# EAGLE schematic MotorBoardDev (EAGLE 8.5.2)
IGVC Motor Control Board
REVISION: v1.1; SCH_DESC: Motor Control Board; TEAM: IGVC

## Sheet 1 of 4: mBed Breakout
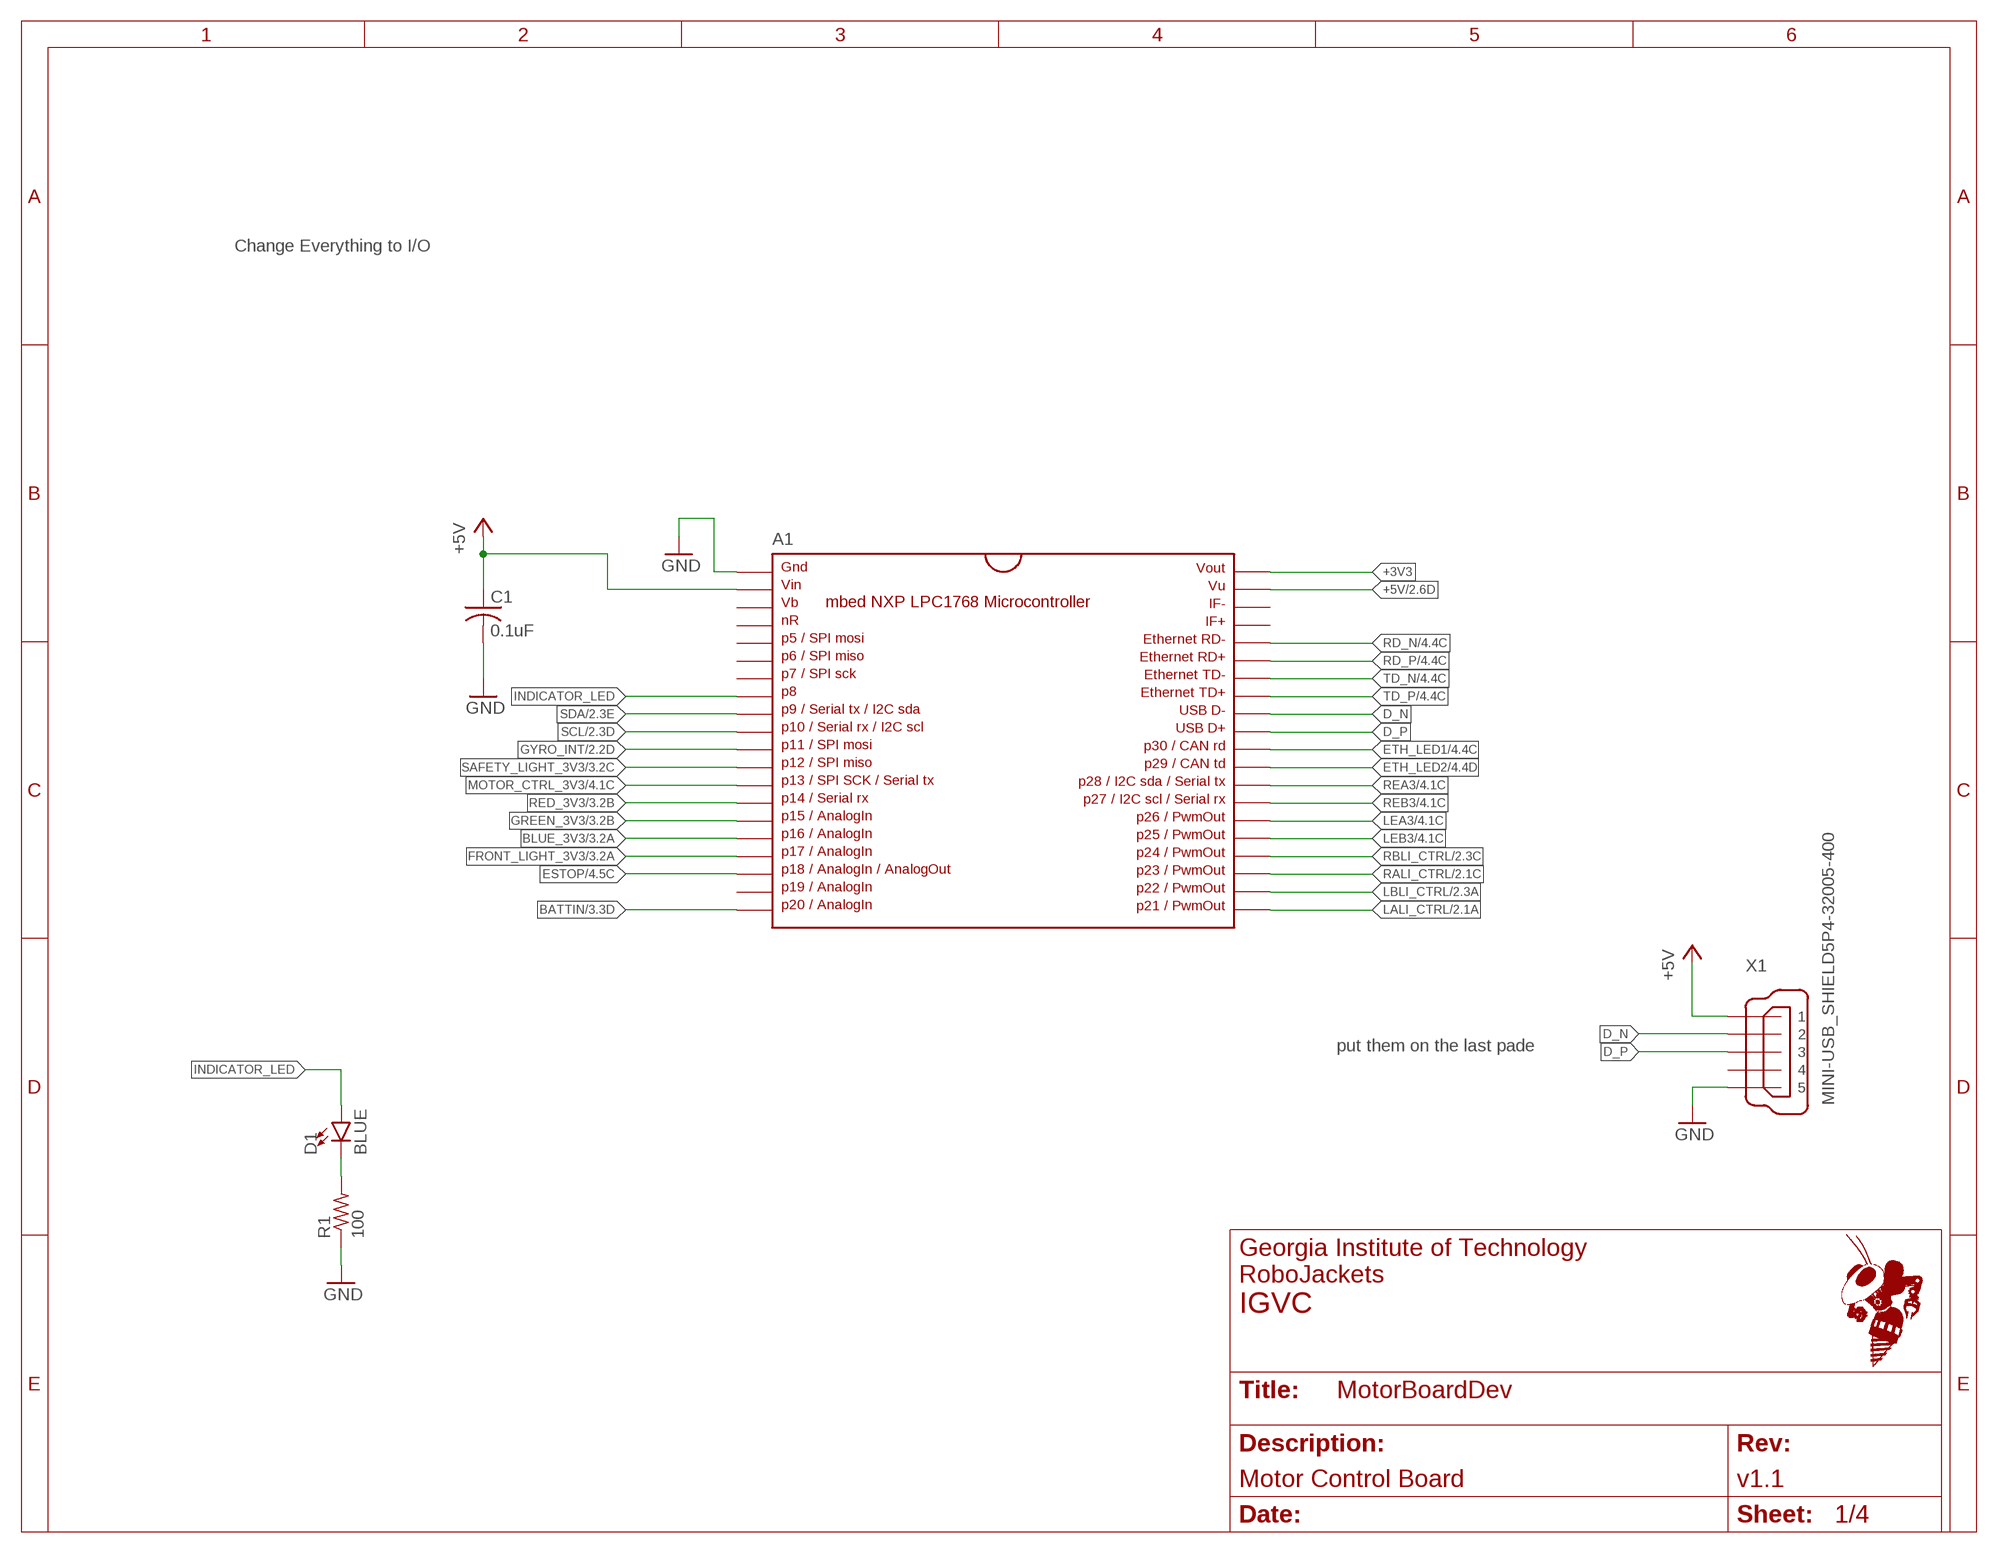
[diagram p0: schematic, sheet 1]

### Parts
A1  MBED1768  SPARKFUN-BOARDS_MBED_NXP_LPC1768  [SPARKFUN-BOARDS_DIL40_0.9]
C1  0.1uF  C-USC0603  [C0603]
D1  BLUE  LED-BLUE0603  [LED-0603]
R1  100  R-US_R0603  [R0603]
X1  MINI-USB_SHIELD5P4-32005-400  [32005-400]

### Nets
+3V3: A1.40 ; also sheet 2,3,4
+5V: A1.2 A1.39 C1.1 X1.1 ; also sheet 2,3,4
BATTIN: A1.20 ; also sheet 3
BLUE_3V3: A1.16 ; also sheet 3
D_N: A1.32 X1.2
D_P: A1.31 X1.3
ESTOP: A1.18 ; also sheet 4
ETH_LED1: A1.30 ; also sheet 4
ETH_LED2: A1.29 ; also sheet 4
FRONT_LIGHT_3V3: A1.17 ; also sheet 3
GND: A1.1 C1.2 R1.1 X1.5 ; also sheet 2,3,4
GREEN_3V3: A1.15 ; also sheet 3
GYRO_INT: A1.11 ; also sheet 2
INDI_LED_R: D1.C R1.2
INDICATOR_LED: A1.8 D1.A
LALI_CTRL: A1.21 ; also sheet 2
LBLI_CTRL: A1.22 ; also sheet 2
LEA3: A1.26 ; also sheet 4
LEB3: A1.25 ; also sheet 4
MOTOR_CTRL_3V3: A1.13 ; also sheet 4
RALI_CTRL: A1.23 ; also sheet 2
RBLI_CTRL: A1.24 ; also sheet 2
RD_N: A1.36 ; also sheet 4
RD_P: A1.35 ; also sheet 4
REA3: A1.28 ; also sheet 4
REB3: A1.27 ; also sheet 4
RED_3V3: A1.14 ; also sheet 3
SAFETY_LIGHT_3V3: A1.12 ; also sheet 3
SCL: A1.10 ; also sheet 2
SDA: A1.9 ; also sheet 2
TD_N: A1.34 ; also sheet 4
TD_P: A1.33 ; also sheet 4
Unconnected: A1.3 A1.4 A1.5 A1.6 A1.7 A1.19 A1.37 A1.38 X1.4 X1.M1(S1) X1.M2(S2) X1.M3(S3) X1.M4(S4)

### Notes on the sheet
- Change Everything to I/O
- put them on the last pade

## Sheet 2 of 4: Motor Control
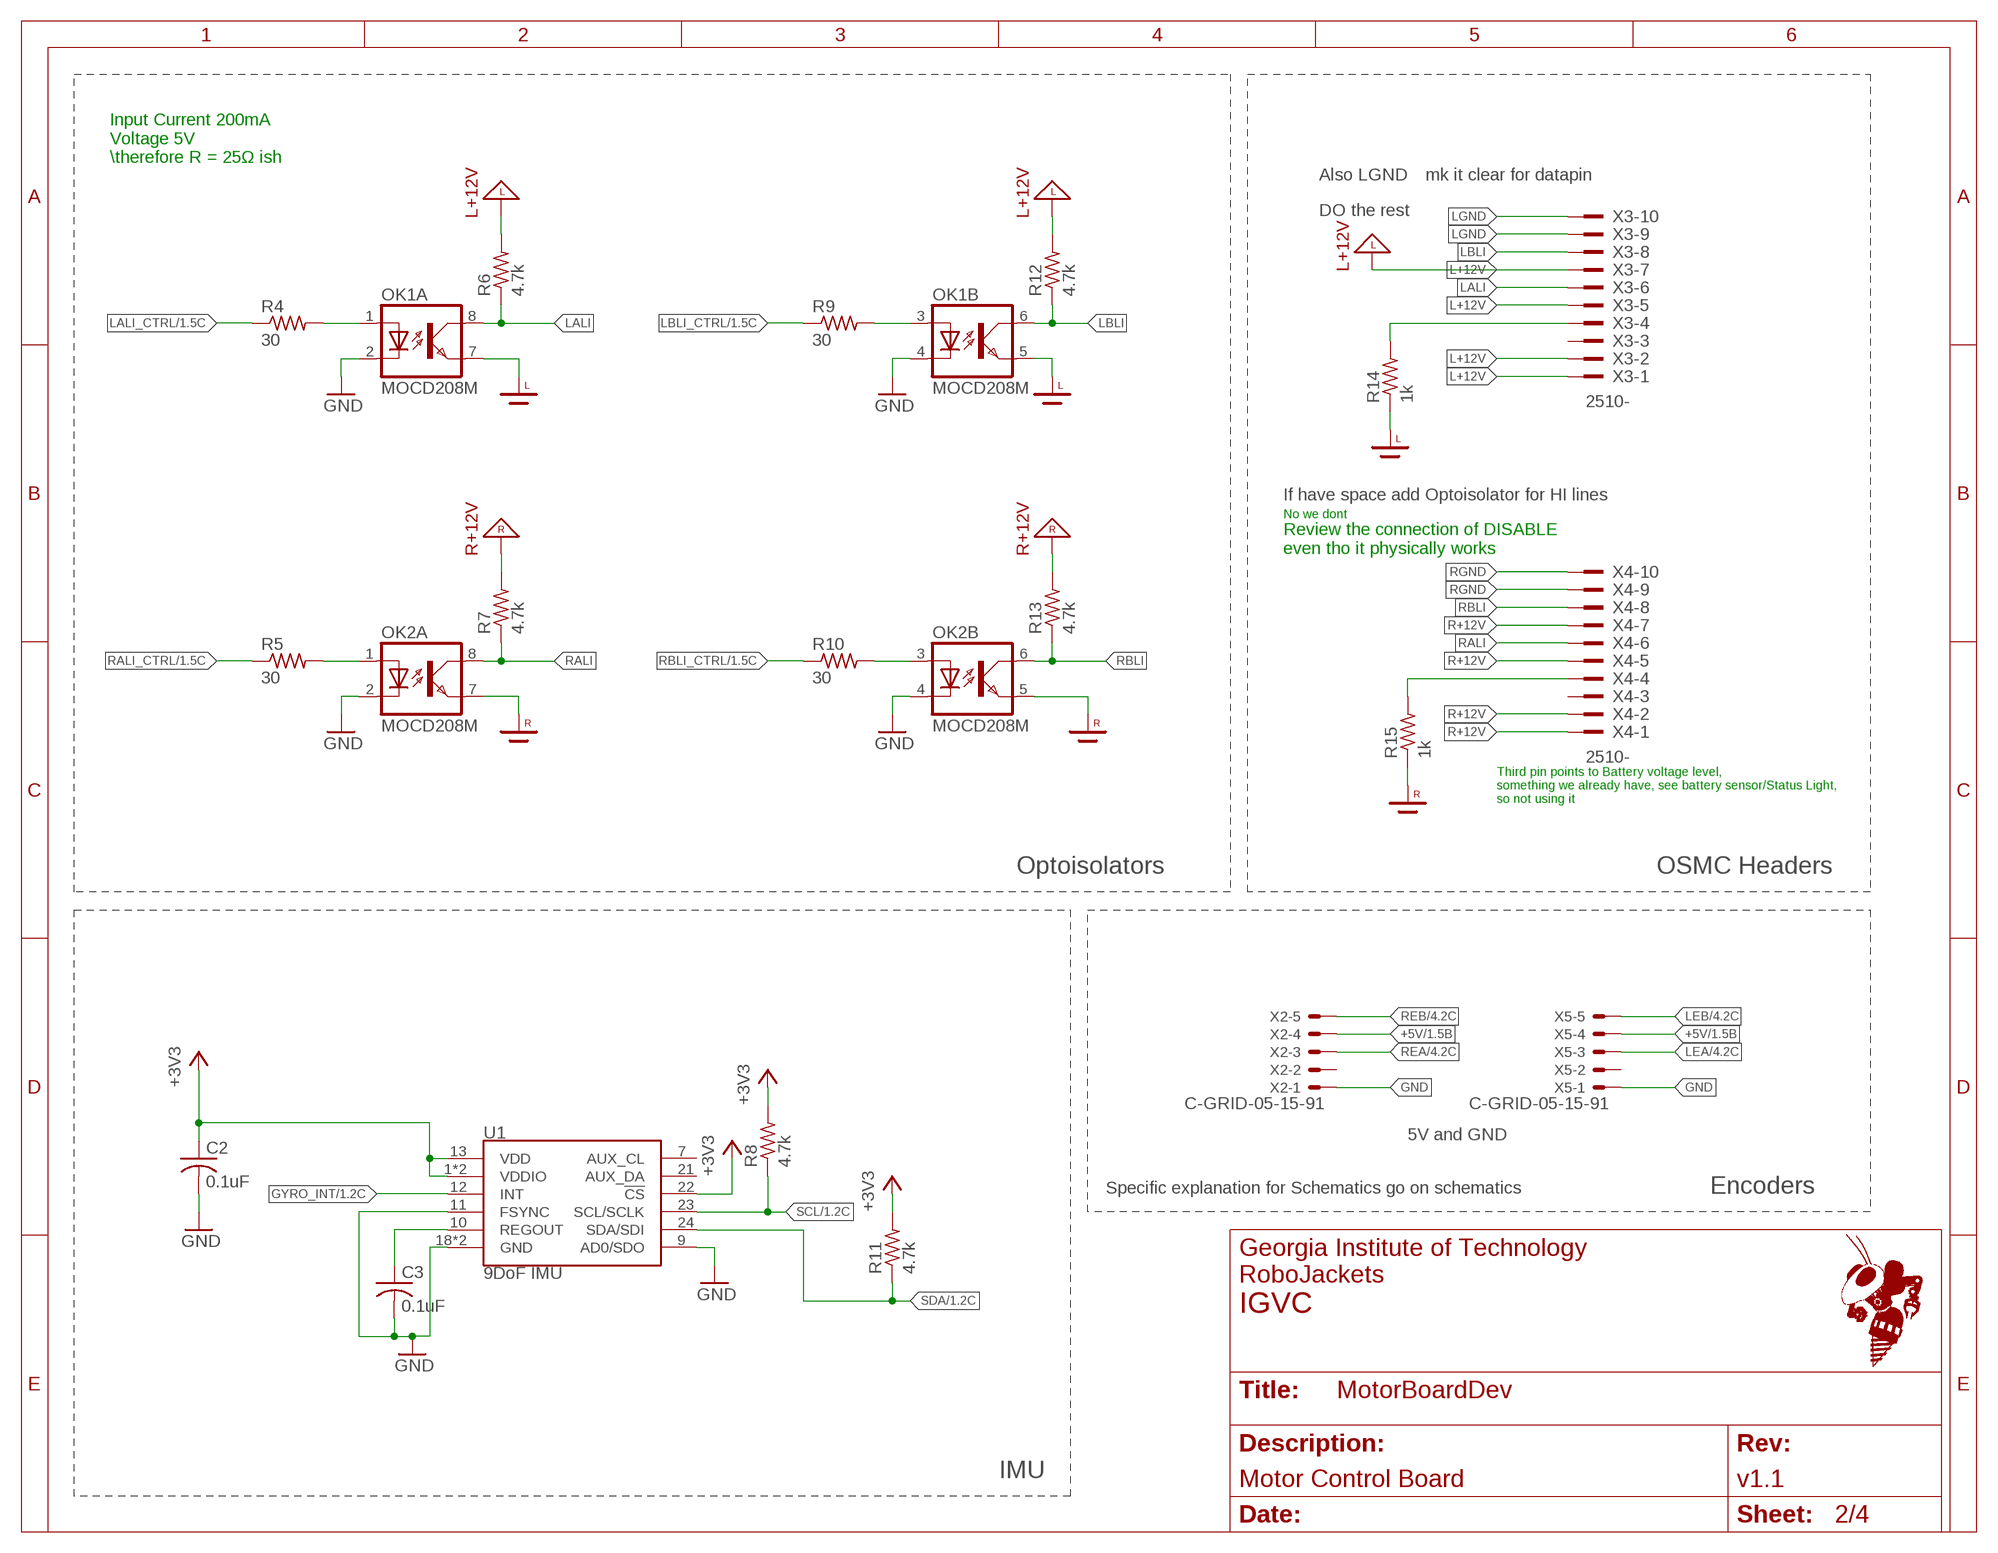
[diagram p1: schematic, sheet 2]

### Parts
C2  0.1uF  C-USC0603  [C0603]
C3  0.1uF  C-USC0603  [C0603]
OK1  MOCD208M  [SOIC08-FAIRCHILD]
OK2  MOCD208M  [SOIC08-FAIRCHILD]
R4  30  R-US_R0603  [R0603]
R5  30  R-US_R0603  [R0603]
R6  4.7k  R-US_R0603  [R0603]
R7  4.7k  R-US_R0603  [R0603]
R8  4.7k  R-US_R0603  [R0603]
R9  30  R-US_R0603  [R0603]
R10  30  R-US_R0603  [R0603]
R11  4.7k  R-US_R0603  [R0603]
R12  4.7k  R-US_R0603  [R0603]
R13  4.7k  R-US_R0603  [R0603]
R14  1k  R-US_R0603  [R0603]
R15  1k  R-US_R0603  [R0603]
U1  9DoF IMU  MPU-9250  [QFN24-3X3]
X2  C-GRID-05-15-91  [15-91-05]
X3  2510-  [PAK100/2500-10]
X4  2510-  [PAK100/2500-10]
X5  C-GRID-05-15-91  [15-91-05]

### Nets
+3V3: C2.1 R8.2 R11.2 U1.1(VDDIO) U1.8(VDDIO) U1.13(VDD) U1.22(!CS) ; also sheet 1,3,4
+5V: X2.4 X5.4 ; also sheet 1,3,4
GND: C2.2 C3.2 OK1.2(A:C) OK1.4(B:C) OK2.2(A:C) OK2.4(B:C) U1.9(AD0/SDO) U1.11(FSYNC) U1.18(GND) U1.20(GND) X2.1 X5.1 ; also sheet 1,3,4
GYRO_INT: U1.12(INT) ; also sheet 1
L+12V: R6.2 R12.2 X3.1 X3.2 X3.5 X3.7
LALI: OK1.8(A:COL) R6.1 X3.6
LALI_CTRL: R4.1 ; also sheet 1
LBLI: OK1.6(B:COL) R12.1 X3.8
LBLI_CTRL: R9.1 ; also sheet 1
LDISABLE: R14.2 X3.4
LEA: X5.3 ; also sheet 4
LEB: X5.5 ; also sheet 4
LGND: OK1.5(B:EMIT) OK1.7(A:EMIT) R14.1 X3.9 X3.10
R+12V: R7.2 R13.2 X4.1 X4.2 X4.5 X4.7
R_OK3A: OK1.1(A:A) R4.2
R_OK3B: OK1.3(B:A) R9.2
R_OK4A: OK2.1(A:A) R5.2
R_OK4B: OK2.3(B:A) R10.2
RALI: OK2.8(A:COL) R7.1 X4.6
RALI_CTRL: R5.1 ; also sheet 1
RBLI: OK2.6(B:COL) R13.1 X4.8
RBLI_CTRL: R10.1 ; also sheet 1
RDISABLE: R15.2 X4.4
REA: X2.3 ; also sheet 4
REB: X2.5 ; also sheet 4
REGOUT_C: C3.1 U1.10(REGOUT)
RGND: OK2.5(B:EMIT) OK2.7(A:EMIT) R15.1 X4.9 X4.10
SCL: R8.1 U1.23(SCL/SCLK) ; also sheet 1
SDA: R11.1 U1.24(SDA/SDI) ; also sheet 1
Unconnected: U1.7(AUX_CL) U1.21(AUX_DA) X2.2 X3.3 X4.3 X5.2

### Notes on the sheet
- Input Current 200mA
  Voltage 5V
  \therefore R = 25Ω ish
- Also LGND | mk it clear for datapin
- DO the rest
- If have space add Optoisolator for HI lines
- No we dont
- Review the connection of DISABLE
  even tho it physically works
- Third pin points to Battery voltage level,
  something we already have, see battery sensor/Status Light,
  so not using it
- Optoisolators | OSMC Headers
- 5V and GND
- Specific explanation for Schematics go on schematics | Encoders
- IMU

## Sheet 3 of 4: Light Control
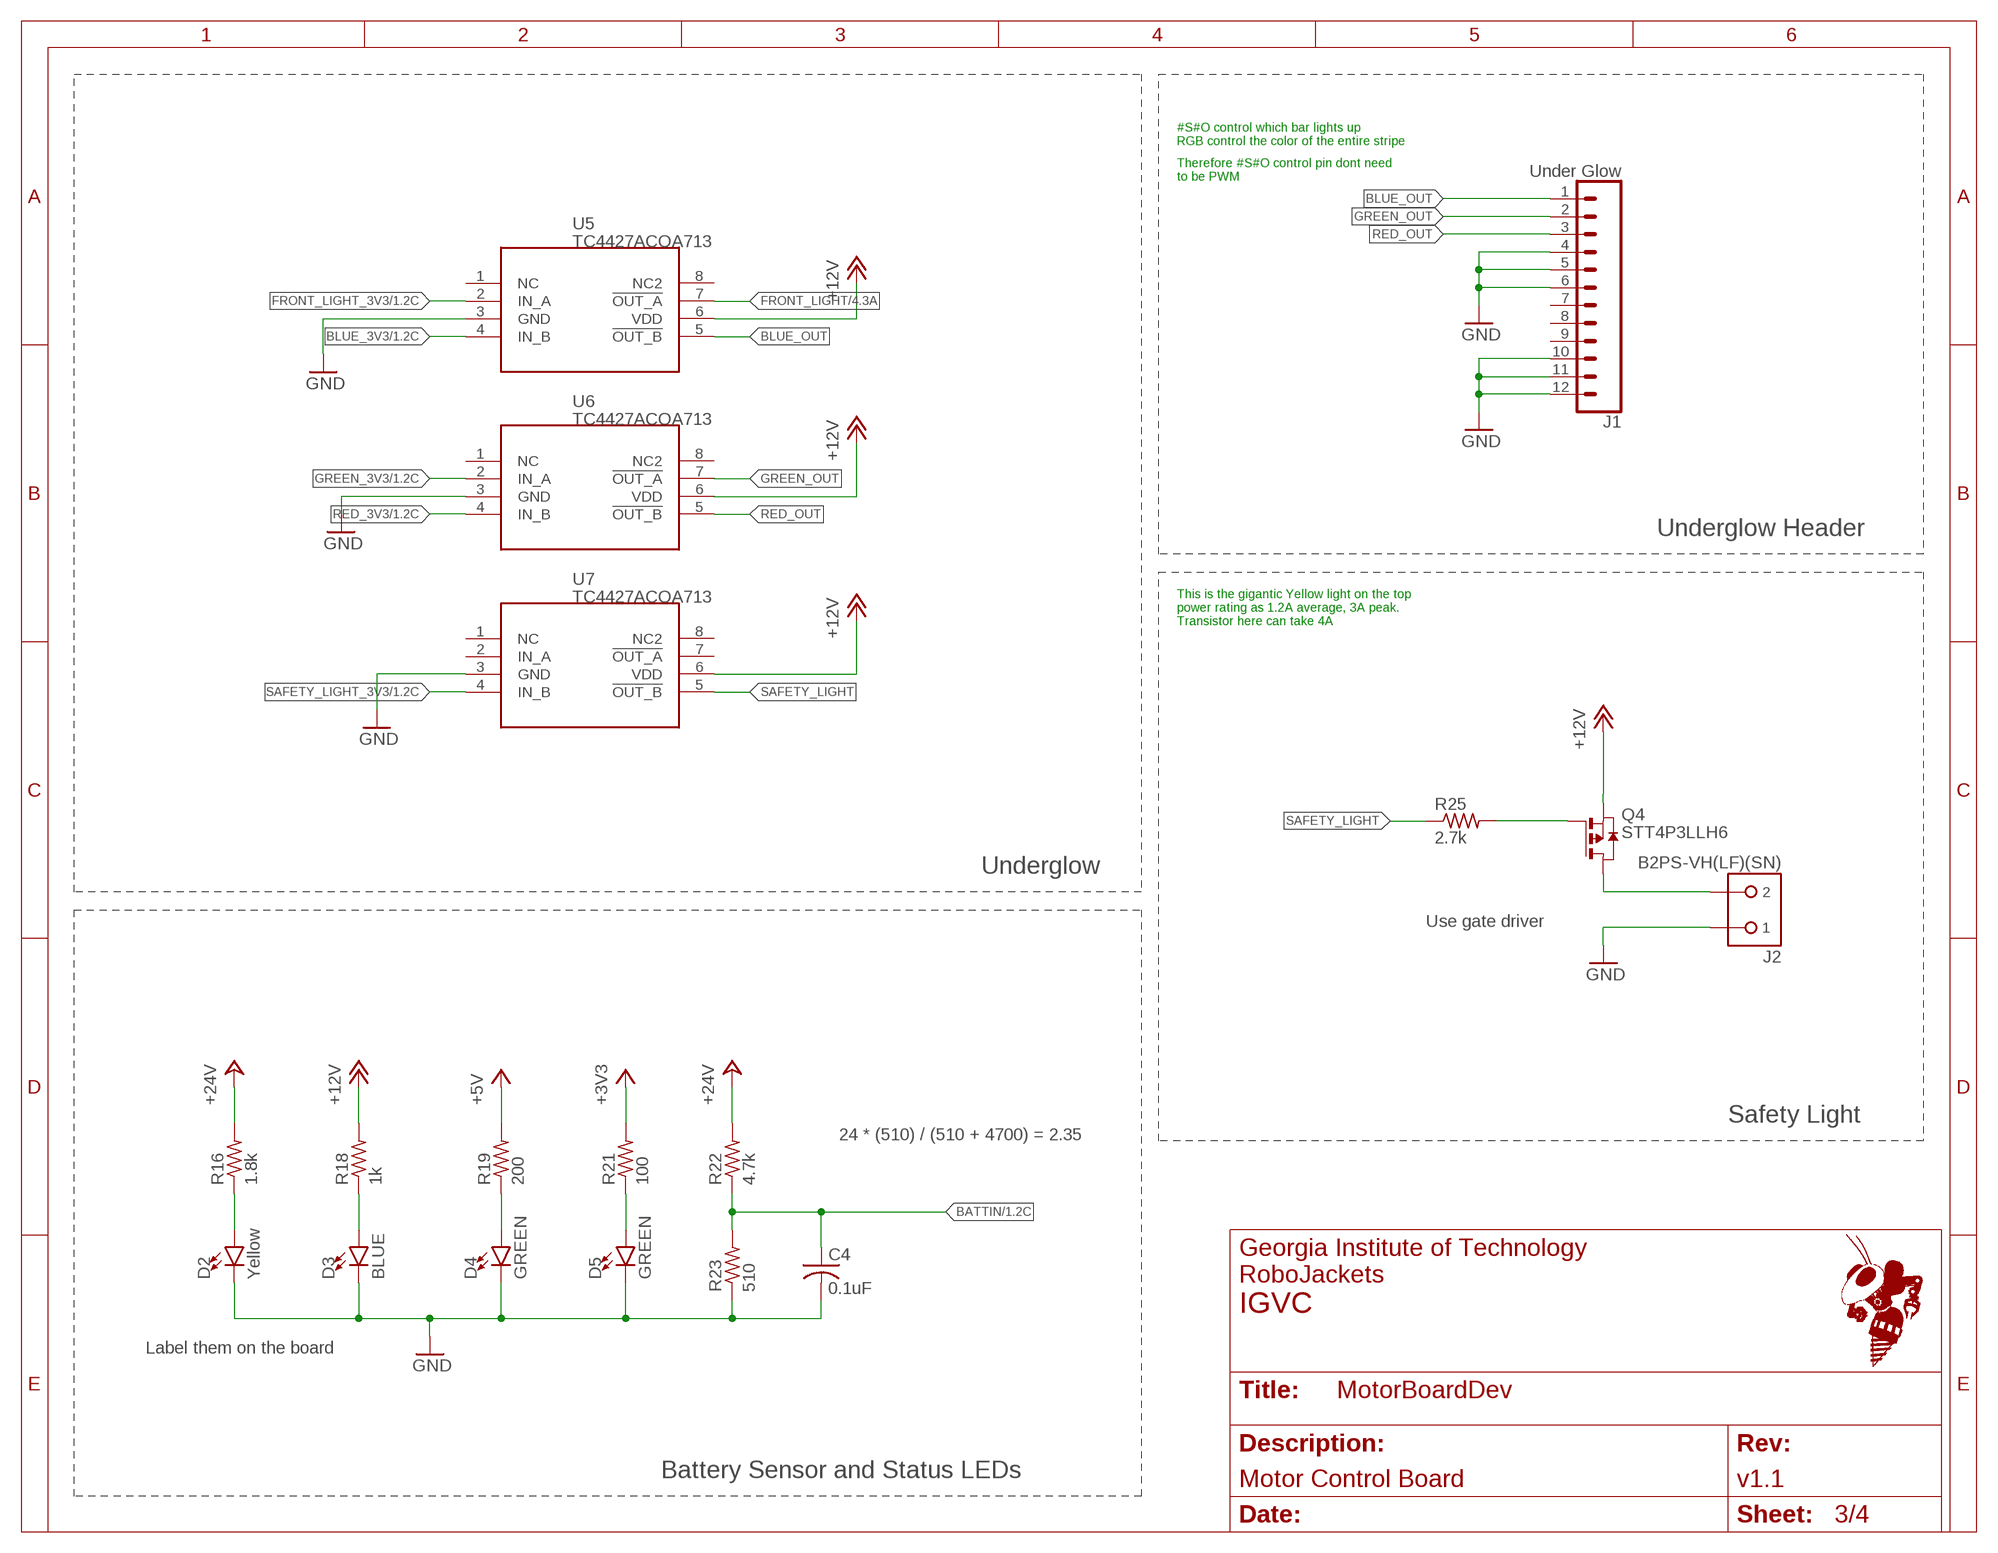
[diagram p2: schematic, sheet 3]

### Parts
C4  0.1uF  C-USC0603  [C0603]
D2  Yellow  LED-YELLOW0603  [LED-0603]
D3  BLUE  LED-BLUE0603  [LED-0603]
D4  GREEN  LED-GREEN0603  [LED-0603]
D5  GREEN  LED-GREEN0603  [LED-0603]
J1  Under Glow  CONN_12LOCK_LONGPADS  [1X12_LOCK_LONGPADS]
J2  B2PS-VH(LF)(SN)  [B2PS-CENTERED]
Q4  STT4P3LLH6  [SOT23-6]
R16  1.8k  R-US_R0603  [R0603]
R18  1k  R-US_R0603  [R0603]
R19  200  R-US_R0603  [R0603]
R21  100  R-US_R0603  [R0603]
R22  4.7k  R-US_R0603  [R0603]
R23  510  R-US_R0603  [R0603]
R25  2.7k  R-US_R0603  [R0603]
U5  TC4427ACOA713  [SOIC-8]
U6  TC4427ACOA713  [SOIC-8]
U7  TC4427ACOA713  [SOIC-8]

### Nets
3V3_LED_R: D5.A R21.1
5V_LED_R: D4.A R19.1
12V_LED_R: D3.A R18.1
24V_LED_R: D2.A R16.1
+3V3: R21.2 ; also sheet 1,2,4
+5V: R19.2 ; also sheet 1,2,4
+12V: Q4.4(S) R18.2 U5.6(VDD) U6.6(VDD) U7.6(VDD) ; also sheet 4
+24V: R16.2 R22.2 ; also sheet 4
BATTIN: C4.1 R22.1 R23.2 ; also sheet 1
BLUE_3V3: U5.4(IN_B) ; also sheet 1
BLUE_OUT: J1.1 U5.5(!OUT_B)
FRONT_LIGHT: U5.7(!OUT_A) ; also sheet 4
FRONT_LIGHT_3V3: U5.2(IN_A) ; also sheet 1
GND: C4.2 D2.C D3.C D4.C D5.C J1.4 J1.5 J1.6 J1.10 J1.11 J1.12 J2.1 R23.1 U5.3(GND) U6.3(GND) U7.3(GND) ; also sheet 1,2,4
GREEN_3V3: U6.2(IN_A) ; also sheet 1
GREEN_OUT: J1.2 U6.7(!OUT_A)
RED_3V3: U6.4(IN_B) ; also sheet 1
RED_OUT: J1.3 U6.5(!OUT_B)
SAFETY_HRD: J2.2 Q4.1(D) Q4.2(D) Q4.5(D) Q4.6(D)
SAFETY_LIGHT: R25.1 U7.5(!OUT_B)
SAFETY_LIGHT_3V3: U7.4(IN_B) ; also sheet 1
SAFETY_R: Q4.3(G) R25.2
Unconnected: J1.7 J1.8 J1.9 U5.1(NC) U5.8(NC2) U6.1(NC) U6.8(NC2) U7.1(NC) U7.2(IN_A) U7.7(!OUT_A) U7.8(NC2)

### Notes on the sheet
- #S#O control which bar lights up
  RGB control the color of the entire stripe
- Therefore #S#O control pin dont need
  to be PWM
- Underglow Header
- This is the gigantic Yellow light on the top
  power rating as 1.2A average, 3A peak.
  Transistor here can take 4A
- Underglow
- Use gate driver
- Safety Light
- 24 * (510) / (510 + 4700) = 2.35
- Label them on the board
- Battery Sensor and Status LEDs

## Sheet 4 of 4: Misc. Power and Headers
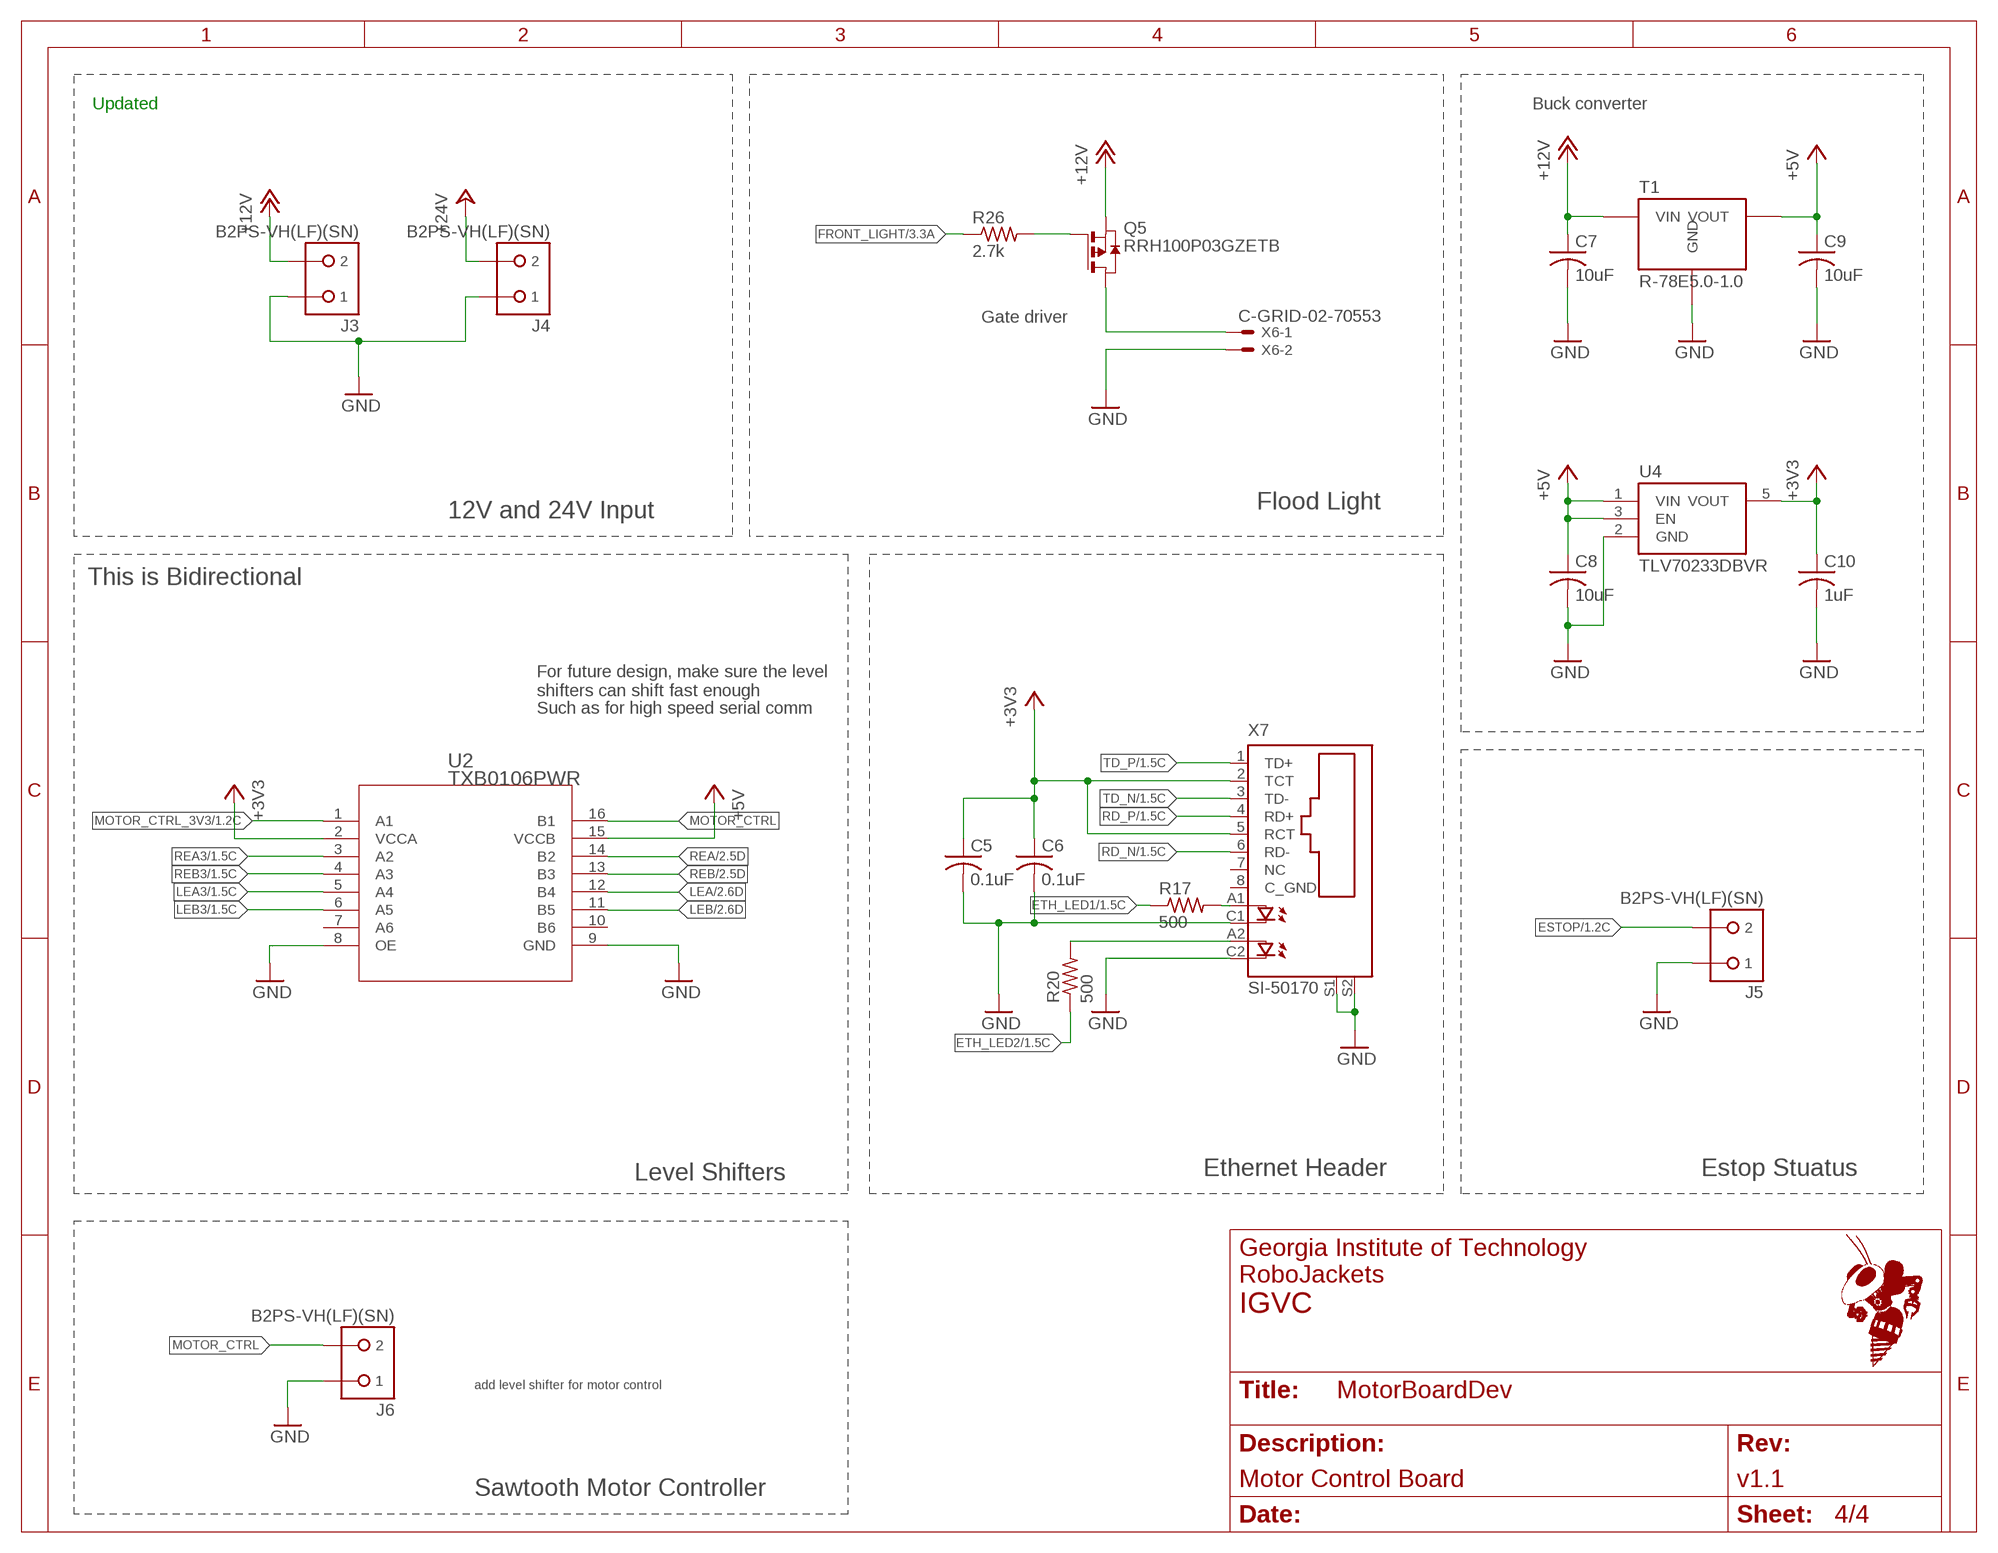
[diagram p3: schematic, sheet 4]

### Parts
C5  0.1uF  C-USC0603  [C0603]
C6  0.1uF  C-USC0603  [C0603]
C7  10uF  C-USC0805  [C0805]
C8  10uF  C-USC0805  [C0805]
C9  10uF  C-USC0805  [C0805]
C10  1uF  C-USC0805  [C0805]
J3  B2PS-VH(LF)(SN)  [B2PS-CENTERED]
J4  B2PS-VH(LF)(SN)  [B2PS-CENTERED]
J5  B2PS-VH(LF)(SN)  [B2PS-CENTERED]
J6  B2PS-VH(LF)(SN)  [B2PS-CENTERED]
Q5  RRH100P03GZETB  [SOIC-8]
R17  500  R-US_R0603  [R0603]
R20  500  R-US_R0603  [R0603]
R26  2.7k  R-US_R0603  [R0603]
T1  R-78E5.0-1.0  [R-78E]
U2  TXB0106PWR  [PW16]
U4  TLV70233DBVR  [SOT-23-5]
X6  C-GRID-02-70553  [70553-02]
X7  SI-50170  [SI-50170]

### Nets
+3V3: C5.1 C6.1 C10.1 U2.2(VCCA) U4.5(VOUT) X7.2(TCT) X7.5(RCT) ; also sheet 1,2,3
+5V: C8.1 C9.1 T1.3(VOUT) U2.15(VCCB) U4.1(VIN) U4.3(EN) ; also sheet 1,2,3
+12V: C7.1 J3.2 Q5.1(S) Q5.2(S) Q5.3(S) T1.1(VIN) ; also sheet 3
+24V: J4.2 ; also sheet 3
ESTOP: J5.2 ; also sheet 1
ETH_LED1: R17.1 ; also sheet 1
ETH_LED2: R20.1 ; also sheet 1
FRONT_HDR: Q5.5(D) Q5.6(D) Q5.7(D) Q5.8(D) X6.1
FRONT_LIGHT: R26.1 ; also sheet 3
FRONT_R: Q5.4(G) R26.2
GND: C5.2 C6.2 C7.2 C8.2 C9.2 C10.2 J3.1 J4.1 J5.1 J6.1 T1.2(GND) U2.8(OE) U2.9(GND) U4.2(GND) X6.2 X7.C1(C) X7.C2(C1) X7.S1 X7.S2 ; also sheet 1,2,3
LEA: U2.12(B4) ; also sheet 2
LEA3: U2.5(A4) ; also sheet 1
LEB: U2.11(B5) ; also sheet 2
LEB3: U2.6(A5) ; also sheet 1
MOTOR_CTRL: J6.2 U2.16(B1)
MOTOR_CTRL_3V3: U2.1(A1) ; also sheet 1
N$1: R17.2 X7.A1(A)
N$2: R20.2 X7.A2(A1)
RD_N: X7.6(RD-) ; also sheet 1
RD_P: X7.4(RD+) ; also sheet 1
REA: U2.14(B2) ; also sheet 2
REA3: U2.3(A2) ; also sheet 1
REB: U2.13(B3) ; also sheet 2
REB3: U2.4(A3) ; also sheet 1
TD_N: X7.3(TD-) ; also sheet 1
TD_P: X7.1(TD+) ; also sheet 1
Unconnected: U2.7(A6) U2.10(B6) X7.7(NC) X7.8(C_GND)

### Notes on the sheet
- Updated | Buck converter
- Gate driver
- Flood Light
- 12V and 24V Input
- This is Bidirectional
- For future design, make sure the level
  shifters can shift fast enough
- Such as for high speed serial comm
- Level Shifters | Ethernet Header | Estop Stuatus
- add level shifter for motor control
- Sawtooth Motor Controller

## Library data of the parts
A1 = MotorBoardDev:SPARKFUN-BOARDS_MBED_NXP_LPC1768: mbed LPC1768 board footprint Boards using this footprint: mbed - LPC1768 (Cortex-M3) (DEV-09564); PROD_ID: COMP-12167
C1-C10 = rcl:C-US: CAPACITOR, American symbol
D1 D3 = SparkFun-LED:LED-BLUE: Blue SMD LED Used in manufacturing of various products at SparkFun Packages: 0603 - SMD 0603 package [Product Link] <http://www.digikey.com/product-detail/en/SMLE12BC7TT86/511-1589-2-ND/1641808> 1206 - SMD1206 package [Product Link] <http://www.digikey.com/product-detail/en/lite-on-inc/LTST-C150TBKT/160-1643-1-ND/573584> SparkFun Products: ESP8266 Thing-Dev Board <https://www.sparkfun.com/products/13711> RedBoard <https://www.sparkfun.com/products/12757>; PROD_ID: DIO-08575
D2 = SparkFun-LED:LED-YELLOW: Yellow SMD LED Used in manufacturing several products at SparkFun. Packages: 0603 - SMD 0603 package[Product Link] <http://www.kingbrightusa.com/product.asp?catalog_name=LED&product_id=APT1608SYCK> 0603 -SMART - SMART SMD 0603 package (more efficient/more expensive) [Product Link] <http://www.osram-os.com/osram_os/en/products/product-catalog/led-light-emitting-diodes/smartled-0603/ly-l29k/index.jsp> LilyPad - SMD1206 package[Product Datasheet] <https://www.sparkfun.com/datasheets/DevTools/LilyPad/Q150YUS4.pdf> SparkFun Products: Blynk Board <https://www.sparkfun.com/products/13794> IOIO-OTG <https://www.sparkfun.com/products/13613> XBee Explorer Serial <https://www.sparkfun.com/products/13225>; PROD_ID: DIO-09003
D4 D5 = SparkFun-LED:LED-GREEN: Green SMD LED Used in manufacturing of various products at SparkFun Packages: 0603 - SMD 0603 package [Product Link] <http://www.futureelectronics.com/en/technologies/semiconductors/optoelectronics/leds/Pages/9894312-LTST-C190GKT.aspx?CrossPart=HSMG-C190&IM=0> LilyPad 1206 - SMD1206 LilyPad package [Product Link] <http://www.futureelectronics.com/en/Technologies/Product.aspx?ProductID=IN150NGHARVATEKCORPORATION2049943&IM=0> 1206 - SMD1206 package [Product Link] <http://www.futureelectronics.com/en/technologies/semiconductors/optoelectronics/leds/Pages/8315665-LTST-C150KGKT.aspx?IM=0> 1206 Bottom Mount -SMD 1206 Bottom Mount [Product Link] <http://www.digikey.com/product-detail/en/lite-on-inc/LTST-C230KGKT/160-1456-1-ND/386854> SparkFun Products: Pro Mini 328 -5V <https://www.sparkfun.com/products/821> RedBoard <https://www.sparkfun.com/products/12757> MP3 Trigger <https://www.sparkfun.com/products/13720> Makey Makey <https://www.sparkfun.com/products/11076>; PROD_ID: DIO-00821
J1 = SparkFun-Connectors:CONN_12: Multi connection point. Often used as Generic Header-pin footprint for 0.1 inch spaced/style header connections On any of the 0.1 inch spaced packages, you can populate with these: Break Away Headers - Straight <https://www.sparkfun.com/products/116> (PRT-00116) Break Away Male Headers - Right Angle <https://www.sparkfun.com/products/553> (PRT-00553) Female Headers <https://www.sparkfun.com/products/115> (PRT-00115) Break Away Headers - Machine Pin <https://www.sparkfun.com/products/117> (PRT-00117) Break Away Female Headers - Swiss Machine Pin <https://www.sparkfun.com/products/743> (PRT-00743) For SCREWTERMINALS and SPRING TERMINALS visit here: Screw Terimnals on SparkFun.com <https://www.sparkfun.com/search/results?term=Screw+Terminals> (5mm/3.5mm/2.54mm spacing) This device is also useful as a general connection point to wire up your design to another part of your project. Our various solder wires solder well into these plated through hole pads. Hook-Up Wire - Assortment (Stranded, 22 AWG) <https://www.sparkfun.com/products/11375> (PRT-11375) Hook-Up Wire - Assortment (Solid Core, 22 AWG) <https://www.sparkfun.com/products/11367> (PRT-11367) View the entire wire category on our website here <https://www.sparkfun.com/categories/141> Special notes: Molex polarized connector foot print use with SKU : PRT-08231 with associated crimp pins and housings. 1MM SMD Version SKU: PRT-10208 NOTES ON THE VARIANTS LOCK and LOCK_LONGPADS... This footprint was designed to help hold the alignment of a through-hole component (i.e. 6-pin header) while soldering it into place. You may notice that each hole has been shifted either up or down by 0.005 of an inch from it's more standard position (which is a perfectly straight line). This slight alteration caused the pins (the squares in the middle) to touch the edges of the holes. Because they are alternating, it causes a "brace" to hold the component in place. 0.005 has proven to be the perfect amount of "off-center" position when using our standard breakaway headers. Although looks a little odd when you look at the bare footprint, once you have a header in there, the alteration is very hard to notice. Also,if you push a header all the way into place, it is covered up entirely on the bottom side.
J2-J6 = RoboJackets-Connectors:B2P?-VH(LF)(SN): Power Connector Brand: JST Sales America Inc. <https://www.jst.com/> Series: VH <http://www.digikey.com/product-search/en?FV=fff40016,fff802f3,ffec0e9d> Distributor: Digi-Key <http://www.digikey.com/product-detail/en/B2PS-VH%28LF%29%28SN%29/455-1648-ND/926555>; DIGIKEY: 455-1648-ND; MPN: B2PS-VH(LF)(SN)
OK1 OK2 = optocoupler:MOCD20*M: MOCD207M, MOCD208M Dual Channel Phototransistor Small Outline Surface Mount Optocouplers Source: Data sheet <http://www.fairchildsemi.com/ds/MO%2FMOCD207-M.pdf>; MF: FAIRCHILD SEMICONDUCTOR; MPN: MOCD208M; OC_FARNELL: 1505465; OC_NEWARK: 34C7498
Q4 = MotorBoardDev:STT4P3LLH6
Q5 = MotorBoardDev:RRH100P03GZETB
R1 R4-R23 R25 R26 = rcl:R-US_: RESISTOR, American symbol
T1 = MotorBoardDev:R-78E5.0-1.0
U1 = SparkFun-Sensors:MPU-9250: MPU-9250 9 Degree of Freedom IMU System in Package that contains MPU-6500 & AK8963 NC pin 19. 2-6 & 14-17 not internally connected. May be used for PCB trace routing. Datasheet <https://cdn.sparkfun.com/assets/learn_tutorials/5/5/0/MPU9250REV1.0.pdf> SparkFun Products: SparkFun 9DoF Razor IMU M0 <https://www.sparkfun.com/products/14001> SparkFun IMU Breakout - MPU-9250 <https://www.sparkfun.com/products/13762>; PROD_ID: IC-13192
U2 = MotorBoardDev:TXB0106PWR; MANUFACTURER_PART_NUMBER: TXB0106PWR; VENDOR: Texas Instruments
U4 = RoboJackets-PowerICs:TLV70233; DIGIKEY: 296-32415-1-ND; MPN: TLV70233DBVR
U5-U7 = MotorBoardDev:TC4427ACOA713
X1 = con-cypressindustries:MINI-USB_SHIELD5P4-: MINI USB-B R/A W/O POST 5 pol. Source: www.cypressindustries.com; OC_FARNELL: unknown; OC_NEWARK: unknown
X2 X5 = con-molex:C-GRID-05: CONNECTOR wire to board 2.54 mm (0.100") pitch header; OC_FARNELL: unknown; OC_NEWARK: unknown
X3 X4 = con-3m:2510-: 3M (TM) Pak 100 4-Wall Header Source: 3M; MF: 3M; MPN: 2510-6002UB; OC_FARNELL: 9838244; OC_NEWARK: 46F4725
X6 = con-molex:C-GRID-02: CONNECTOR wire to board 2.54 mm (0.100") pitch header; OC_FARNELL: unknown; OC_NEWARK: unknown
X7 = con-stewart:SI-50170: Ethernet Connector MagJack (R) Source: www.stewartconnector.com .. si-50170.pdf; OC_FARNELL: unknown; OC_NEWARK: unknown